# Altium schematic sheet Greinke_Boost_Converter_Electromagnet(Schematic).SchDoc
size A; SheetNumber: 2; SheetTotal: 2
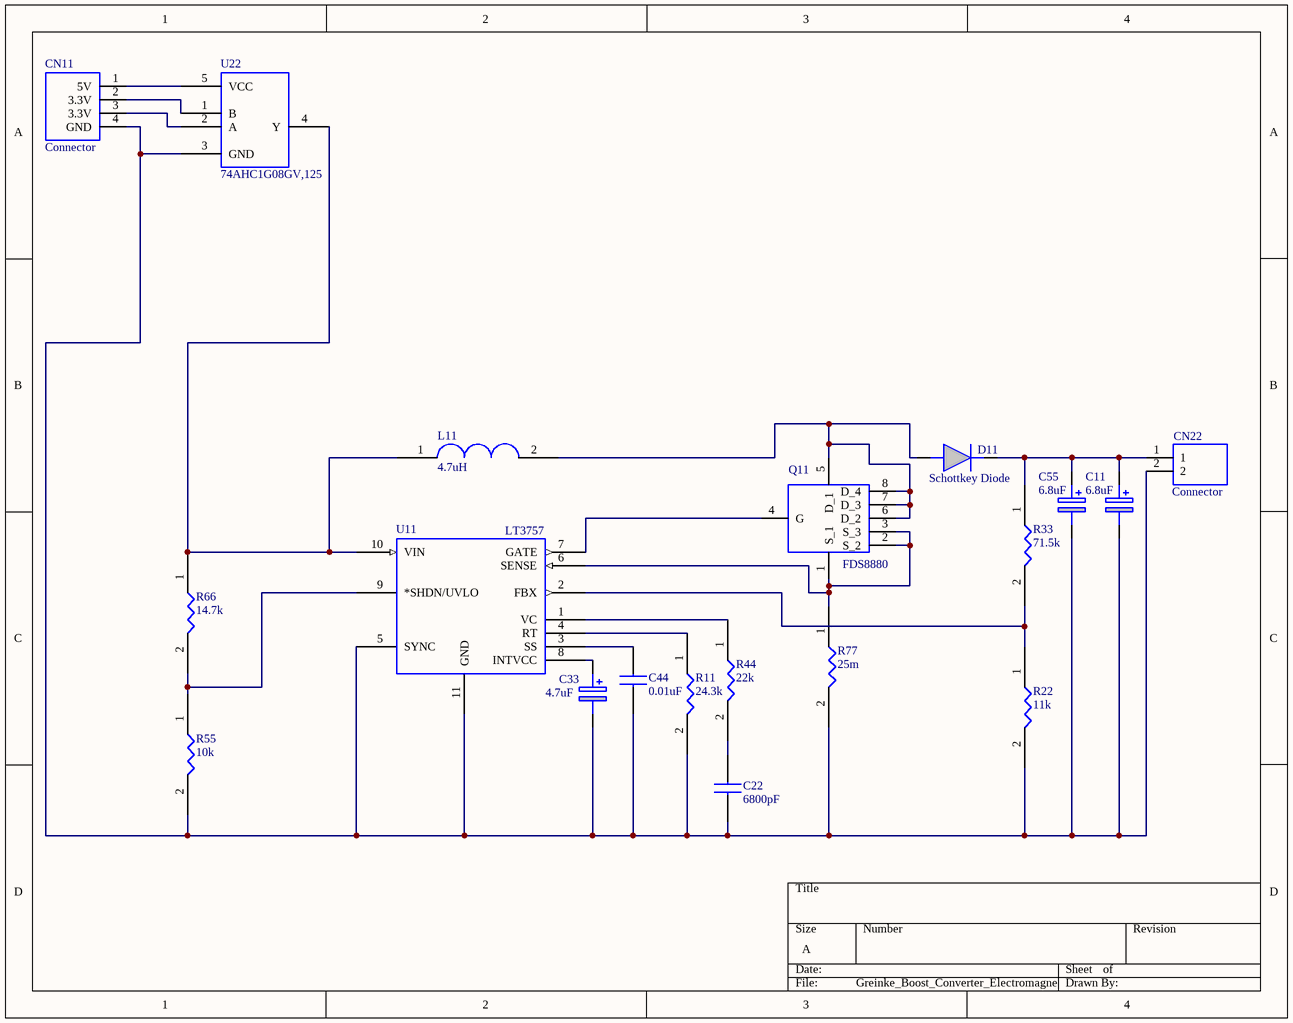
[diagram p0: Greinke_Boost_Converter_Electromagnet(Schematic).SchDoc]

## Parts
C11  6.8uF  [6.8u Capacitor]
C22  6800pF  [6800p Capacitor]
C33  4.7uF  [4.7u Capacitor]
C44  0.01uF  [0.01u Capacitor]
C55  6.8uF  [6.8u Capacitor]
CN11  Connector  [4 Terminal Block]
CN22  Connector  [2 Terminal Blocks]
D11  Schottkey Diode  [MBRS340]
L11  4.7uH  [744774047]
Q11  FDS8880  [FDS8880]
R11  24.3k  [24.3k Resistor]
R22  11k  [11k Resistor]
R33  71.5k  [71.5k Resistor]
R44  22k  [22k Resistor]
R55  10k  [10k Resistor]
R66  14.7k  [14.7k Resistor]
R77  25m  [25m Resistor]
U11  LT3757  [LT3757]
U22  74AHC1G08GV,125  [74AHC1G08GV,125]

## Nets
NetC11_1: C11.1(+) C55.1(+) CN22.1 D11.1(K) R33.1
NetC11_2: C11.2(-) C22.2 C33.2(-) C44.1 C55.2(-) CN11.4(GND) CN22.2 R11.2 R22.2 R55.2 R77.2 U11.5(SYNC) U11.11(GND) U22.3(GND)
NetC22_1: C22.1 R44.2
NetC33_1: C33.1(+) U11.8(INTVCC)
NetC44_2: C44.2 U11.3(SS)
NetCN11_1: CN11.1(5V) U22.5(VCC)
NetCN11_2: CN11.2(3.3V) U22.1(B)
NetCN11_3: CN11.3(3.3V) U22.2(A)
NetD11_2: D11.2(A) L11.2 Q11.5(D_1) Q11.6(D_2) Q11.7(D_3) Q11.8(D_4)
NetL11_1: L11.1 R66.1 U11.10(VIN) U22.4(Y)
NetQ11_1: Q11.1(S_1) Q11.2(S_2) Q11.3(S_3) R77.1 U11.6(SENSE)
NetQ11_4: Q11.4(G) U11.7(GATE)
NetR11_1: R11.1 U11.4(RT)
NetR22_1: R22.1 R33.2 U11.2(FBX)
NetR44_1: R44.1 U11.1(VC)
NetR55_1: R55.1 R66.2 U11.9(*SHDN/UVLO)

## Library data of the parts
C11 C55 = 6.8u Capacitor
C22 = 6800p Capacitor
C33 = 4.7u Capacitor
C44 = 0.01u Capacitor_1
CN11 = 4 Terminal Block
CN22 = 2 Terminal Blocks
D11 = MBRS340
L11 = 744774047
R11 = 24.3k Resistor
R22 = 11k Resistor
R33 = 71.5k Resistor
R44 = 22k Resistor
R55 = 10k Resistor
R66 = 14.7k Resistor
R77 = 25m Resistor